# Altium project pwr_fpga.PrjPCB
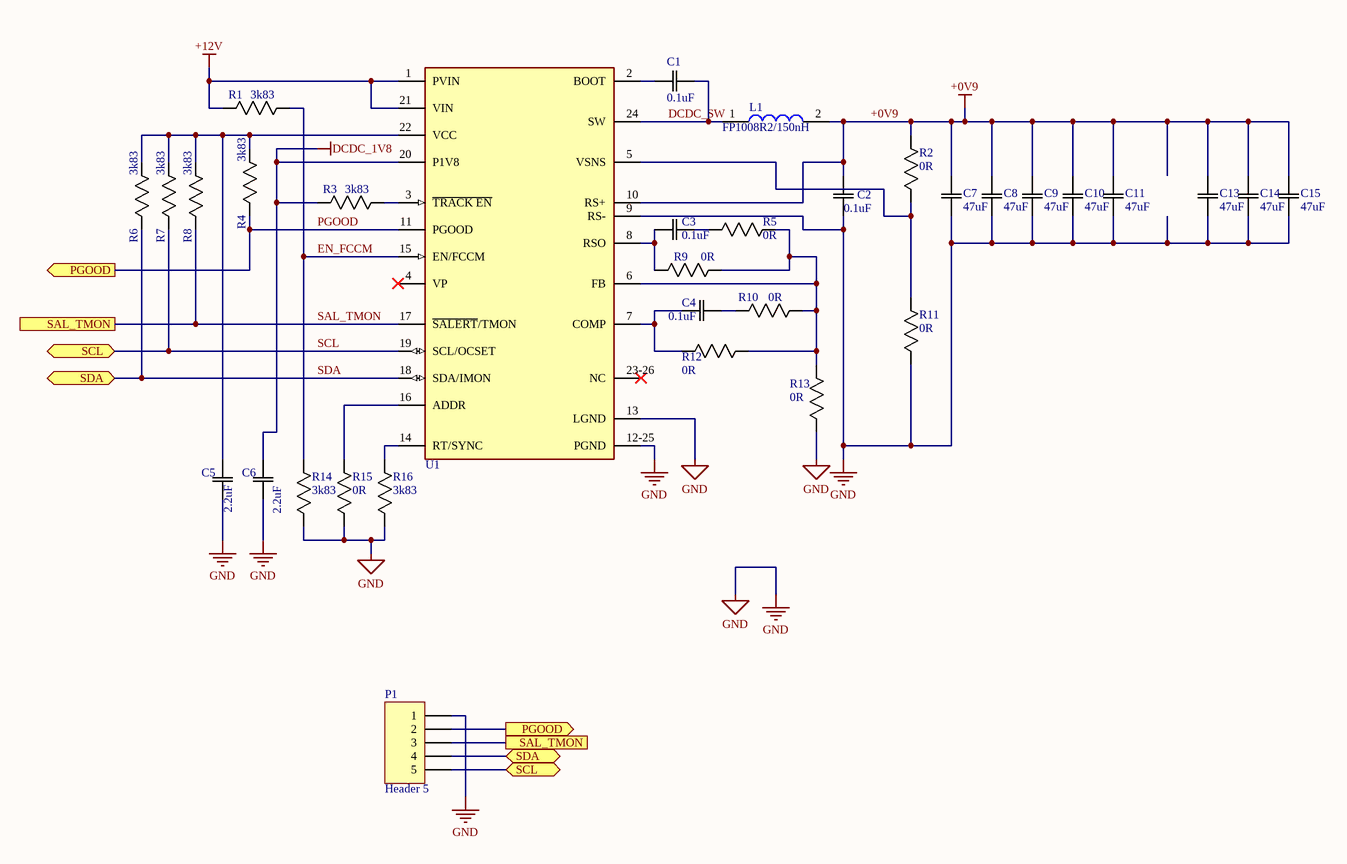
[diagram p0: pwr_fpga.SchDoc]
1 sheet, 33 parts. Net scope: flat (ports and power ports of the same name join across sheets).
Board file: pwr_fpga.PcbDoc

## Sheet pwr_fpga.SchDoc
size A3

### Parts
C1  0.1uF  [cap_UMK105 CG080CV-F_TAY]
C2  0.1uF  [cap_UMK105 CG080CV-F_TAY]
C3  0.1uF  [cap_UMK105 CG080CV-F_TAY]
C4  0.1uF  [cap_UMK105 CG080CV-F_TAY]
C5  2.2uF  [cap_UMK105 CG080CV-F_TAY]
C6  2.2uF  [cap_UMK105 CG080CV-F_TAY]
C7  47uF  [CAPC220145_140N_KEM]
C8  47uF  [CAPC220145_140N_KEM]
C9  47uF  [CAPC220145_140N_KEM]
C10  47uF  [CAPC220145_140N_KEM]
C11  47uF  [CAPC220145_140N_KEM]
C13  47uF  [CAPC220145_140N_KEM]
C14  47uF  [CAPC220145_140N_KEM]
C15  47uF  [CAPC220145_140N_KEM]
L1  FP1008R2/150nH  [INDM10880X800N]
P1  Header 5  [HDR1X5]
R1  3k83  [0402_PAN]
R2  0R  [0402_PAN]
R3  3k83  [0402_PAN]
R4  3k83  [0402_PAN]
R5  0R  [0402_PAN]
R6  3k83  [0402_PAN]
R7  3k83  [0402_PAN]
R8  3k83  [0402_PAN]
R9  0R  [0402_PAN]
R10  0R  [0402_PAN]
R11  0R  [0402_PAN]
R12  0R  [0402_PAN]
R13  0R  [0402_PAN]
R14  3k83  [0402_PAN]
R15  0R  [0402_PAN]
R16  3k83  [0402_PAN]
U1  IR38064MTRPBF  [Infineon_Technologies_PG-IQFN-34_MFG]  (value not drawn)

### Ports
PGOOD (out), SAL_TMON, SCL (bidir), SDA (bidir)

### Nets
+0V9: C2.2 C7.2 C8.2 C9.2 C10.2 C11.2 C13.2 C14.2 C15.2 L1.2 R2.1 U1.10(RS+)
+12V: R1.2 U1.1(PVIN) U1.21(VIN)
DCDC_1V8: C6.2 R3.2 U1.20(P1V8)
GND: C2.1 C5.1 C6.1 C7.1 C8.1 C9.1 C10.1 C11.1 C13.1 C14.1 C15.1 P1.1 R11.2 R13.2 R14.2 R15.1 R16.1 U1.9(RS-) U1.12-25(PGND) U1.13(LGND)
DCDC_SW: C1.2 L1.1 U1.24(SW)
EN_FCCM: R1.1 R14.1 U1.15(EN/FCCM)
PGOOD: P1.2 R4.1 U1.11(PGOOD) ; port PGOOD
SAL_TMON: P1.3 R8.1 U1.17(~{SALERT}/TMON) ; port SAL_TMON
SCL: P1.5 R7.1 U1.19(SCL/OCSET) ; port SCL
SDA: P1.4 R6.1 U1.18(SDA/IMON) ; port SDA
NetC1_1: C1.1 U1.2(BOOT)
NetC3_1: C3.1 R9.2 U1.8(RSO)
NetC3_2: C3.2 R5.2
NetC4_1: C4.1 R12.2 U1.7(COMP)
NetC4_2: C4.2 R10.2
NetC5_2: C5.2 R4.2 R6.2 R7.2 R8.2 U1.22(VCC)
NetR2_2: R2.2 R11.1 U1.5(VSNS)
NetR3_1: R3.1 U1.3(~{TRACK_EN})
NetR5_1: R5.1 R9.1 R10.1 R12.1 R13.1 U1.6(FB)
NetR15_2: R15.2 U1.16(ADDR)
NetR16_2: R16.2 U1.14(RT/SYNC)

Not connected (* = marked no-connect by the designer): U1 4(VP)* 23-26(NC)*

### Library data of the parts
C1-C6 = TMK105B7103KV-F: No Description Available; Vendor: Taiyo Yuden; Built_By: EMA_UL_Team; SourceLibrary: Taiyo_Yuden_2018-10-17; Type: DEV; Manufacturer_Part_Number: TMK105B7103KV-F; Copyright: Copyright (C) 2018 Accelerated Designs. All rights reserved; RefDes: RefDes
C7-C11 C13-C15 = C0805C475K4PAC: No Description Available; Vendor: Kemet; SourceLibrary: Kemet_2020-03-25_1b; Built_By: EMA_Frank; Type: DEV; Manufacturer_Part_Number: C0805C475K4PAC; Copyright: Copyright (C) 2018 Accelerated Designs. All rights reserved; RefDes: RefDes
L1 = FP1008R2-R120-R: Inductor; Manufacturer_Name: Eaton; Datasheet Link: https://datasheet.octopart.com/FP1008R2-R120-R-Coiltronics-datasheet-49700686.pdf; Height: 8mm; Manufacturer_Part_Number: FP1008R2-R120-R; Arrow Part Number: FP1008R2-R120-R; Mouser Part Number: 704-FP1008R2-R120-R; Mouser Price/Stock: https://www.mouser.com/Search/Refine.aspx?Keyword=704-FP1008R2-R120-R
P1 = Header 5: Header, 5-Pin; LatestRevisionDate: 17-Jul-2002; LatestRevisionNote: Re-released for DXP Platform.; Publisher: Altium Limited
R1-R16 = ERJ2RHD2400X: No Description Available; Vendor: Panasonic; Built_By: EMA_UL_Team; SourceLibrary: Panasonic_2016-11-1; Manufacturer_Part_Number: ERJ2RHD2400X; Copyright: Copyright (C) 2018 Accelerated Designs. All rights reserved; RefDes: RefDes; Type: DEV